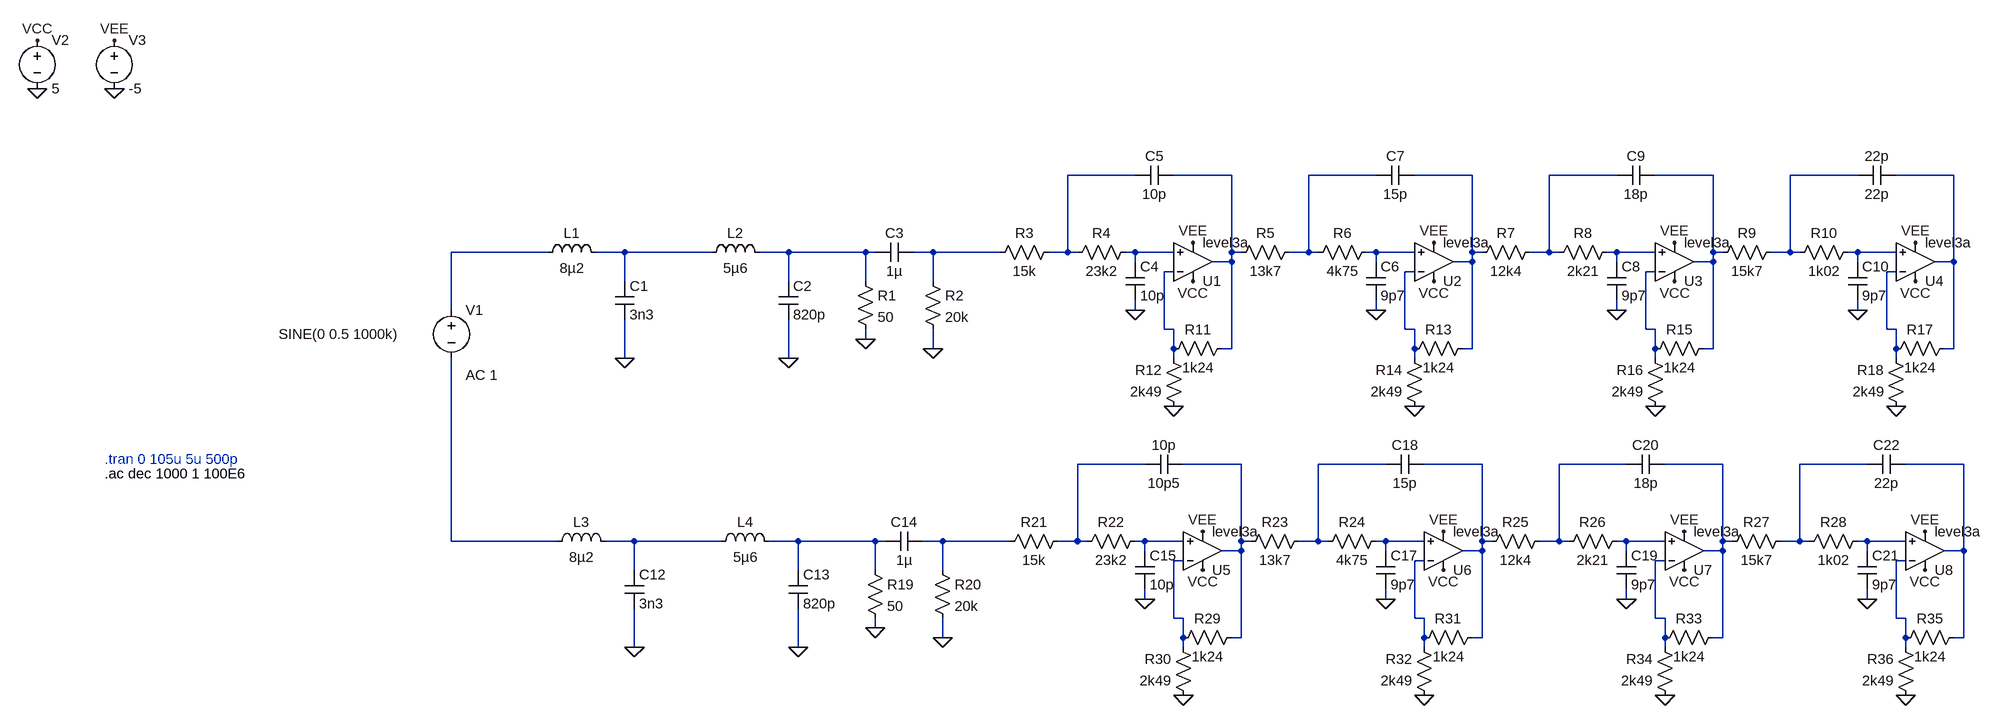
[diagram p0: schematic DAC_FILTER.asc]
DAC_FILTER.asc, the LTspice schematic file:
Version 4
SHEET 1 2488 804
WIRE 1104 -80 992 -80
WIRE 1264 -80 1168 -80
WIRE 1504 -80 1392 -80
WIRE 1664 -80 1568 -80
WIRE 1904 -80 1792 -80
WIRE 2064 -80 1968 -80
WIRE 2304 -80 2192 -80
WIRE 2464 -80 2368 -80
WIRE 128 48 -32 48
WIRE 256 48 208 48
WIRE 400 48 256 48
WIRE 528 48 480 48
WIRE 656 48 528 48
WIRE 672 48 656 48
WIRE 768 48 736 48
WIRE 880 48 768 48
WIRE 992 48 992 -80
WIRE 992 48 960 48
WIRE 1008 48 992 48
WIRE 1104 48 1088 48
WIRE 1168 48 1104 48
WIRE 1264 48 1264 -80
WIRE 1280 48 1264 48
WIRE 1392 48 1392 -80
WIRE 1392 48 1360 48
WIRE 1408 48 1392 48
WIRE 1504 48 1488 48
WIRE 1568 48 1504 48
WIRE 1664 48 1664 -80
WIRE 1680 48 1664 48
WIRE 1792 48 1792 -80
WIRE 1792 48 1760 48
WIRE 1808 48 1792 48
WIRE 1904 48 1888 48
WIRE 1968 48 1904 48
WIRE 2064 48 2064 -80
WIRE 2080 48 2064 48
WIRE 2192 48 2192 -80
WIRE 2192 48 2160 48
WIRE 2208 48 2192 48
WIRE 2304 48 2288 48
WIRE 2368 48 2304 48
WIRE 1104 64 1104 48
WIRE 1264 64 1264 48
WIRE 1264 64 1232 64
WIRE 1504 64 1504 48
WIRE 1664 64 1664 48
WIRE 1664 64 1632 64
WIRE 1904 64 1904 48
WIRE 2064 64 2064 48
WIRE 2064 64 2032 64
WIRE 2304 64 2304 48
WIRE 2464 64 2464 -80
WIRE 2464 64 2432 64
WIRE 1168 80 1152 80
WIRE 1568 80 1552 80
WIRE 1968 80 1952 80
WIRE 2368 80 2352 80
WIRE 256 96 256 48
WIRE 528 96 528 48
WIRE 656 96 656 48
WIRE 768 96 768 48
WIRE -32 144 -32 48
WIRE 1104 144 1104 128
WIRE 1504 144 1504 128
WIRE 1904 144 1904 128
WIRE 2304 144 2304 128
WIRE 1152 176 1152 80
WIRE 1168 176 1152 176
WIRE 1552 176 1552 80
WIRE 1568 176 1552 176
WIRE 1952 176 1952 80
WIRE 1968 176 1952 176
WIRE 2352 176 2352 80
WIRE 2368 176 2352 176
WIRE 656 192 656 176
WIRE 768 208 768 176
WIRE 1168 208 1168 176
WIRE 1264 208 1264 64
WIRE 1264 208 1248 208
WIRE 1568 208 1568 176
WIRE 1664 208 1664 64
WIRE 1664 208 1648 208
WIRE 1968 208 1968 176
WIRE 2064 208 2064 64
WIRE 2064 208 2048 208
WIRE 2368 208 2368 176
WIRE 2464 208 2464 64
WIRE 2464 208 2448 208
WIRE 256 224 256 160
WIRE 528 224 528 160
WIRE 1168 224 1168 208
WIRE 1568 224 1568 208
WIRE 1968 224 1968 208
WIRE 2368 224 2368 208
WIRE 1120 400 1008 400
WIRE 1280 400 1184 400
WIRE 1520 400 1408 400
WIRE 1680 400 1584 400
WIRE 1920 400 1808 400
WIRE 2080 400 1984 400
WIRE 2320 400 2208 400
WIRE 2480 400 2384 400
WIRE -32 528 -32 224
WIRE 144 528 -32 528
WIRE 272 528 224 528
WIRE 416 528 272 528
WIRE 544 528 496 528
WIRE 672 528 544 528
WIRE 688 528 672 528
WIRE 784 528 752 528
WIRE 896 528 784 528
WIRE 1008 528 1008 400
WIRE 1008 528 976 528
WIRE 1024 528 1008 528
WIRE 1120 528 1104 528
WIRE 1184 528 1120 528
WIRE 1280 528 1280 400
WIRE 1296 528 1280 528
WIRE 1408 528 1408 400
WIRE 1408 528 1376 528
WIRE 1424 528 1408 528
WIRE 1520 528 1504 528
WIRE 1584 528 1520 528
WIRE 1680 528 1680 400
WIRE 1696 528 1680 528
WIRE 1808 528 1808 400
WIRE 1808 528 1776 528
WIRE 1824 528 1808 528
WIRE 1920 528 1904 528
WIRE 1984 528 1920 528
WIRE 2080 528 2080 400
WIRE 2096 528 2080 528
WIRE 2208 528 2208 400
WIRE 2208 528 2176 528
WIRE 2224 528 2208 528
WIRE 2320 528 2304 528
WIRE 2384 528 2320 528
WIRE 1120 544 1120 528
WIRE 1280 544 1280 528
WIRE 1280 544 1248 544
WIRE 1520 544 1520 528
WIRE 1680 544 1680 528
WIRE 1680 544 1648 544
WIRE 1920 544 1920 528
WIRE 2080 544 2080 528
WIRE 2080 544 2048 544
WIRE 2320 544 2320 528
WIRE 2480 544 2480 400
WIRE 2480 544 2448 544
WIRE 1184 560 1168 560
WIRE 1584 560 1568 560
WIRE 1984 560 1968 560
WIRE 2384 560 2368 560
WIRE 272 576 272 528
WIRE 544 576 544 528
WIRE 672 576 672 528
WIRE 784 576 784 528
WIRE 1120 624 1120 608
WIRE 1520 624 1520 608
WIRE 1920 624 1920 608
WIRE 2320 624 2320 608
WIRE 1168 656 1168 560
WIRE 1184 656 1168 656
WIRE 1568 656 1568 560
WIRE 1584 656 1568 656
WIRE 1968 656 1968 560
WIRE 1984 656 1968 656
WIRE 2368 656 2368 560
WIRE 2384 656 2368 656
WIRE 672 672 672 656
WIRE 784 688 784 656
WIRE 1184 688 1184 656
WIRE 1280 688 1280 544
WIRE 1280 688 1264 688
WIRE 1584 688 1584 656
WIRE 1680 688 1680 544
WIRE 1680 688 1664 688
WIRE 1984 688 1984 656
WIRE 2080 688 2080 544
WIRE 2080 688 2064 688
WIRE 2384 688 2384 656
WIRE 2480 688 2480 544
WIRE 2480 688 2464 688
WIRE 272 704 272 640
WIRE 544 704 544 640
WIRE 1184 704 1184 688
WIRE 1584 704 1584 688
WIRE 1984 704 1984 688
WIRE 2384 704 2384 688
FLAG 256 224 0
FLAG 528 224 0
FLAG 656 192 0
FLAG 768 208 0
FLAG -592 -224 0
FLAG -720 -224 0
FLAG -720 -304 VCC
FLAG 1200 96 VCC
FLAG -592 -304 VEE
FLAG 1200 32 VEE
FLAG 1104 144 0
FLAG 1600 96 VCC
FLAG 1600 32 VEE
FLAG 1504 144 0
FLAG 2000 96 VCC
FLAG 2000 32 VEE
FLAG 1904 144 0
FLAG 2400 96 VCC
FLAG 2400 32 VEE
FLAG 2304 144 0
FLAG 1168 304 0
FLAG 1568 304 0
FLAG 1968 304 0
FLAG 2368 304 0
FLAG 272 704 0
FLAG 544 704 0
FLAG 672 672 0
FLAG 784 688 0
FLAG 1216 576 VCC
FLAG 1216 512 VEE
FLAG 1120 624 0
FLAG 1616 576 VCC
FLAG 1616 512 VEE
FLAG 1520 624 0
FLAG 2016 576 VCC
FLAG 2016 512 VEE
FLAG 1920 624 0
FLAG 2416 576 VCC
FLAG 2416 512 VEE
FLAG 2320 624 0
FLAG 1184 784 0
FLAG 1584 784 0
FLAG 1984 784 0
FLAG 2384 784 0
SYMBOL voltage -32 128 R0
WINDOW 3 -287 56 Left 2
WINDOW 123 24 124 Left 2
WINDOW 39 0 0 Left 0
SYMATTR Value SINE(0 0.5 1000k)
SYMATTR Value2 AC 1
SYMATTR InstName V1
SYMBOL ind 112 64 R270
WINDOW 0 32 56 VTop 2
WINDOW 3 5 56 VBottom 2
SYMATTR InstName L1
SYMATTR Value 8µ2
SYMBOL ind 384 64 R270
WINDOW 0 32 56 VTop 2
WINDOW 3 5 56 VBottom 2
SYMATTR InstName L2
SYMATTR Value 5µ6
SYMBOL cap 240 96 R0
SYMATTR InstName C1
SYMATTR Value 3n3
SYMBOL cap 512 96 R0
SYMATTR InstName C2
SYMATTR Value 820p
SYMBOL res 640 80 R0
SYMATTR InstName R1
SYMATTR Value 50
SYMBOL cap 736 32 R90
WINDOW 0 0 32 VBottom 2
WINDOW 3 32 32 VTop 2
SYMATTR InstName C3
SYMATTR Value 1µ
SYMBOL res 752 80 R0
SYMATTR InstName R2
SYMATTR Value 20k
SYMBOL OpAmps\\UniversalOpAmp3 1200 64 M180
SYMATTR InstName U1
SYMATTR Value2 Avol=4000 GBW=100Meg Slew=560Meg
SYMBOL voltage -720 -320 R0
WINDOW 123 0 0 Left 0
WINDOW 39 0 0 Left 0
SYMATTR InstName V2
SYMATTR Value 5
SYMBOL voltage -592 -320 R0
WINDOW 123 0 0 Left 0
WINDOW 39 0 0 Left 0
SYMATTR InstName V3
SYMATTR Value -5
SYMBOL res 976 32 R90
WINDOW 0 0 56 VBottom 2
WINDOW 3 32 56 VTop 2
SYMATTR InstName R3
SYMATTR Value 15k
SYMBOL res 1104 32 R90
WINDOW 0 0 56 VBottom 2
WINDOW 3 32 56 VTop 2
SYMATTR InstName R4
SYMATTR Value 23k2
SYMBOL cap 1088 64 R0
SYMATTR InstName C4
SYMATTR Value 10p
SYMBOL cap 1168 -96 R90
WINDOW 0 0 32 VBottom 2
WINDOW 3 32 32 VTop 2
SYMATTR InstName C5
SYMATTR Value 10p
SYMBOL OpAmps\\UniversalOpAmp3 1600 64 M180
SYMATTR InstName U2
SYMATTR Value2 Avol=4000 GBW=100Meg Slew=560Meg
SYMBOL res 1376 32 R90
WINDOW 0 0 56 VBottom 2
WINDOW 3 32 56 VTop 2
SYMATTR InstName R5
SYMATTR Value 13k7
SYMBOL res 1504 32 R90
WINDOW 0 0 56 VBottom 2
WINDOW 3 32 56 VTop 2
SYMATTR InstName R6
SYMATTR Value 4k75
SYMBOL cap 1488 64 R0
SYMATTR InstName C6
SYMATTR Value 9p7
SYMBOL cap 1568 -96 R90
WINDOW 0 0 32 VBottom 2
WINDOW 3 32 32 VTop 2
SYMATTR InstName C7
SYMATTR Value 15p
SYMBOL OpAmps\\UniversalOpAmp3 2000 64 M180
SYMATTR InstName U3
SYMATTR Value2 Avol=4000 GBW=100Meg Slew=560Meg
SYMBOL res 1776 32 R90
WINDOW 0 0 56 VBottom 2
WINDOW 3 32 56 VTop 2
SYMATTR InstName R7
SYMATTR Value 12k4
SYMBOL res 1904 32 R90
WINDOW 0 0 56 VBottom 2
WINDOW 3 32 56 VTop 2
SYMATTR InstName R8
SYMATTR Value 2k21
SYMBOL cap 1888 64 R0
SYMATTR InstName C8
SYMATTR Value 9p7
SYMBOL cap 1968 -96 R90
WINDOW 0 0 32 VBottom 2
WINDOW 3 32 32 VTop 2
SYMATTR InstName C9
SYMATTR Value 18p
SYMBOL OpAmps\\UniversalOpAmp3 2400 64 M180
SYMATTR InstName U4
SYMATTR Value2 Avol=4000 GBW=100Meg Slew=560Meg
SYMBOL res 2176 32 R90
WINDOW 0 0 56 VBottom 2
WINDOW 3 32 56 VTop 2
SYMATTR InstName R9
SYMATTR Value 15k7
SYMBOL res 2304 32 R90
WINDOW 0 0 56 VBottom 2
WINDOW 3 32 56 VTop 2
SYMATTR InstName R10
SYMATTR Value 1k02
SYMBOL cap 2288 64 R0
SYMATTR InstName C10
SYMATTR Value 9p7
SYMBOL cap 2368 -96 R90
WINDOW 0 0 32 VBottom 2
WINDOW 3 32 32 VTop 2
SYMATTR InstName 22p
SYMATTR Value 22p
SYMBOL res 1264 192 R90
WINDOW 0 0 56 VBottom 2
WINDOW 3 32 56 VTop 2
SYMATTR InstName R11
SYMATTR Value 1k24
SYMBOL res 1184 320 R180
WINDOW 0 36 76 Left 2
WINDOW 3 36 40 Left 2
SYMATTR InstName R12
SYMATTR Value 2k49
SYMBOL res 1664 192 R90
WINDOW 0 0 56 VBottom 2
WINDOW 3 32 56 VTop 2
SYMATTR InstName R13
SYMATTR Value 1k24
SYMBOL res 1584 320 R180
WINDOW 0 36 76 Left 2
WINDOW 3 36 40 Left 2
SYMATTR InstName R14
SYMATTR Value 2k49
SYMBOL res 2064 192 R90
WINDOW 0 0 56 VBottom 2
WINDOW 3 32 56 VTop 2
SYMATTR InstName R15
SYMATTR Value 1k24
SYMBOL res 1984 320 R180
WINDOW 0 36 76 Left 2
WINDOW 3 36 40 Left 2
SYMATTR InstName R16
SYMATTR Value 2k49
SYMBOL res 2464 192 R90
WINDOW 0 0 56 VBottom 2
WINDOW 3 32 56 VTop 2
SYMATTR InstName R17
SYMATTR Value 1k24
SYMBOL res 2384 320 R180
WINDOW 0 36 76 Left 2
WINDOW 3 36 40 Left 2
SYMATTR InstName R18
SYMATTR Value 2k49
SYMBOL ind 128 544 R270
WINDOW 0 32 56 VTop 2
WINDOW 3 5 56 VBottom 2
SYMATTR InstName L3
SYMATTR Value 8µ2
SYMBOL ind 400 544 R270
WINDOW 0 32 56 VTop 2
WINDOW 3 5 56 VBottom 2
SYMATTR InstName L4
SYMATTR Value 5µ6
SYMBOL cap 256 576 R0
SYMATTR InstName C12
SYMATTR Value 3n3
SYMBOL cap 528 576 R0
SYMATTR InstName C13
SYMATTR Value 820p
SYMBOL res 656 560 R0
SYMATTR InstName R19
SYMATTR Value 50
SYMBOL cap 752 512 R90
WINDOW 0 0 32 VBottom 2
WINDOW 3 32 32 VTop 2
SYMATTR InstName C14
SYMATTR Value 1µ
SYMBOL res 768 560 R0
SYMATTR InstName R20
SYMATTR Value 20k
SYMBOL OpAmps\\UniversalOpAmp3 1216 544 M180
SYMATTR InstName U5
SYMATTR Value2 Avol=4000 GBW=100Meg Slew=560Meg
SYMBOL res 992 512 R90
WINDOW 0 0 56 VBottom 2
WINDOW 3 32 56 VTop 2
SYMATTR InstName R21
SYMATTR Value 15k
SYMBOL res 1120 512 R90
WINDOW 0 0 56 VBottom 2
WINDOW 3 32 56 VTop 2
SYMATTR InstName R22
SYMATTR Value 23k2
SYMBOL cap 1104 544 R0
SYMATTR InstName C15
SYMATTR Value 10p
SYMBOL cap 1184 384 R90
WINDOW 0 0 32 VBottom 2
WINDOW 3 32 32 VTop 2
SYMATTR InstName 10p
SYMATTR Value 10p5
SYMBOL OpAmps\\UniversalOpAmp3 1616 544 M180
SYMATTR InstName U6
SYMATTR Value2 Avol=4000 GBW=100Meg Slew=560Meg
SYMBOL res 1392 512 R90
WINDOW 0 0 56 VBottom 2
WINDOW 3 32 56 VTop 2
SYMATTR InstName R23
SYMATTR Value 13k7
SYMBOL res 1520 512 R90
WINDOW 0 0 56 VBottom 2
WINDOW 3 32 56 VTop 2
SYMATTR InstName R24
SYMATTR Value 4k75
SYMBOL cap 1504 544 R0
SYMATTR InstName C17
SYMATTR Value 9p7
SYMBOL cap 1584 384 R90
WINDOW 0 0 32 VBottom 2
WINDOW 3 32 32 VTop 2
SYMATTR InstName C18
SYMATTR Value 15p
SYMBOL OpAmps\\UniversalOpAmp3 2016 544 M180
SYMATTR InstName U7
SYMATTR Value2 Avol=4000 GBW=100Meg Slew=560Meg
SYMBOL res 1792 512 R90
WINDOW 0 0 56 VBottom 2
WINDOW 3 32 56 VTop 2
SYMATTR InstName R25
SYMATTR Value 12k4
SYMBOL res 1920 512 R90
WINDOW 0 0 56 VBottom 2
WINDOW 3 32 56 VTop 2
SYMATTR InstName R26
SYMATTR Value 2k21
SYMBOL cap 1904 544 R0
SYMATTR InstName C19
SYMATTR Value 9p7
SYMBOL cap 1984 384 R90
WINDOW 0 0 32 VBottom 2
WINDOW 3 32 32 VTop 2
SYMATTR InstName C20
SYMATTR Value 18p
SYMBOL OpAmps\\UniversalOpAmp3 2416 544 M180
SYMATTR InstName U8
SYMATTR Value2 Avol=4000 GBW=100Meg Slew=560Meg
SYMBOL res 2192 512 R90
WINDOW 0 0 56 VBottom 2
WINDOW 3 32 56 VTop 2
SYMATTR InstName R27
SYMATTR Value 15k7
SYMBOL res 2320 512 R90
WINDOW 0 0 56 VBottom 2
WINDOW 3 32 56 VTop 2
SYMATTR InstName R28
SYMATTR Value 1k02
SYMBOL cap 2304 544 R0
SYMATTR InstName C21
SYMATTR Value 9p7
SYMBOL cap 2384 384 R90
WINDOW 0 0 32 VBottom 2
WINDOW 3 32 32 VTop 2
SYMATTR InstName C22
SYMATTR Value 22p
SYMBOL res 1280 672 R90
WINDOW 0 0 56 VBottom 2
WINDOW 3 32 56 VTop 2
SYMATTR InstName R29
SYMATTR Value 1k24
SYMBOL res 1200 800 R180
WINDOW 0 36 76 Left 2
WINDOW 3 36 40 Left 2
SYMATTR InstName R30
SYMATTR Value 2k49
SYMBOL res 1680 672 R90
WINDOW 0 0 56 VBottom 2
WINDOW 3 32 56 VTop 2
SYMATTR InstName R31
SYMATTR Value 1k24
SYMBOL res 1600 800 R180
WINDOW 0 36 76 Left 2
WINDOW 3 36 40 Left 2
SYMATTR InstName R32
SYMATTR Value 2k49
SYMBOL res 2080 672 R90
WINDOW 0 0 56 VBottom 2
WINDOW 3 32 56 VTop 2
SYMATTR InstName R33
SYMATTR Value 1k24
SYMBOL res 2000 800 R180
WINDOW 0 36 76 Left 2
WINDOW 3 36 40 Left 2
SYMATTR InstName R34
SYMATTR Value 2k49
SYMBOL res 2480 672 R90
WINDOW 0 0 56 VBottom 2
WINDOW 3 32 56 VTop 2
SYMATTR InstName R35
SYMATTR Value 1k24
SYMBOL res 2400 800 R180
WINDOW 0 36 76 Left 2
WINDOW 3 36 40 Left 2
SYMATTR InstName R36
SYMATTR Value 2k49
TEXT -608 416 Left 2 !.ac dec 1000 1 100E6
TEXT -608 392 Left 2 ;.tran 0 105u 5u 500p

The netlist it stands for:
* DAC_FILTER.asc
V1 N009 N029 SINE(0 0.5 1000k) AC 1
L1 N009 N010 8µ2
L2 N010 N011 5µ6
C1 N010 0 3n3
C2 N011 0 820p
R1 N011 0 50
C3 N012 N011 1µ
R2 N012 0 20k
XU1 N013 N017 VCC VEE N002 level3a Avol=4000 GBW=100Meg Slew=560Meg Ilimit=25m Rail=0 Vos=0 Phimargin=45 En=0 Enk=0 In=0 Ink=0 Rin=500Meg  ; pins In+ In- V+ V- OUT
V2 VCC 0 5
V3 VEE 0 -5
R3 N001 N012 15k
R4 N013 N001 23k2
C4 N013 0 10p
C5 N002 N001 10p
XU2 N014 N018 VCC VEE N004 level3a Avol=4000 GBW=100Meg Slew=560Meg Ilimit=25m Rail=0 Vos=0 Phimargin=45 En=0 Enk=0 In=0 Ink=0 Rin=500Meg  ; pins In+ In- V+ V- OUT
R5 N003 N002 13k7
R6 N014 N003 4k75
C6 N014 0 9p7
C7 N004 N003 15p
XU3 N015 N019 VCC VEE N006 level3a Avol=4000 GBW=100Meg Slew=560Meg Ilimit=25m Rail=0 Vos=0 Phimargin=45 En=0 Enk=0 In=0 Ink=0 Rin=500Meg  ; pins In+ In- V+ V- OUT
R7 N005 N004 12k4
R8 N015 N005 2k21
C8 N015 0 9p7
C9 N006 N005 18p
XU4 N016 N020 VCC VEE N008 level3a Avol=4000 GBW=100Meg Slew=560Meg Ilimit=25m Rail=0 Vos=0 Phimargin=45 En=0 Enk=0 In=0 Ink=0 Rin=500Meg  ; pins In+ In- V+ V- OUT
R9 N007 N006 15k7
R10 N016 N007 1k02
C10 N016 0 9p7
C§22p N008 N007 22p
R11 N002 N017 1k24
R12 0 N017 2k49
R13 N004 N018 1k24
R14 0 N018 2k49
R15 N006 N019 1k24
R16 0 N019 2k49
R17 N008 N020 1k24
R18 0 N020 2k49
L3 N029 N030 8µ2
L4 N030 N031 5µ6
C12 N030 0 3n3
C13 N031 0 820p
R19 N031 0 50
C14 N032 N031 1µ
R20 N032 0 20k
XU5 N033 N037 VCC VEE N022 level3a Avol=4000 GBW=100Meg Slew=560Meg Ilimit=25m Rail=0 Vos=0 Phimargin=45 En=0 Enk=0 In=0 Ink=0 Rin=500Meg  ; pins In+ In- V+ V- OUT
R21 N021 N032 15k
R22 N033 N021 23k2
C15 N033 0 10p
C§10p N022 N021 10p5
XU6 N034 N038 VCC VEE N024 level3a Avol=4000 GBW=100Meg Slew=560Meg Ilimit=25m Rail=0 Vos=0 Phimargin=45 En=0 Enk=0 In=0 Ink=0 Rin=500Meg  ; pins In+ In- V+ V- OUT
R23 N023 N022 13k7
R24 N034 N023 4k75
C17 N034 0 9p7
C18 N024 N023 15p
XU7 N035 N039 VCC VEE N026 level3a Avol=4000 GBW=100Meg Slew=560Meg Ilimit=25m Rail=0 Vos=0 Phimargin=45 En=0 Enk=0 In=0 Ink=0 Rin=500Meg  ; pins In+ In- V+ V- OUT
R25 N025 N024 12k4
R26 N035 N025 2k21
C19 N035 0 9p7
C20 N026 N025 18p
XU8 N036 N040 VCC VEE N028 level3a Avol=4000 GBW=100Meg Slew=560Meg Ilimit=25m Rail=0 Vos=0 Phimargin=45 En=0 Enk=0 In=0 Ink=0 Rin=500Meg  ; pins In+ In- V+ V- OUT
R27 N027 N026 15k7
R28 N036 N027 1k02
C21 N036 0 9p7
C22 N028 N027 22p
R29 N022 N037 1k24
R30 0 N037 2k49
R31 N024 N038 1k24
R32 0 N038 2k49
R33 N026 N039 1k24
R34 0 N039 2k49
R35 N028 N040 1k24
R36 0 N040 2k49
.ac dec 1000 1 100E6
* .tran 0 105u 5u 500p
.backanno
.end